# EAGLE design PowerNode.v1 (EAGLE 7.2.0)
ABBREV: aa2; PROJECT: AA Power plug
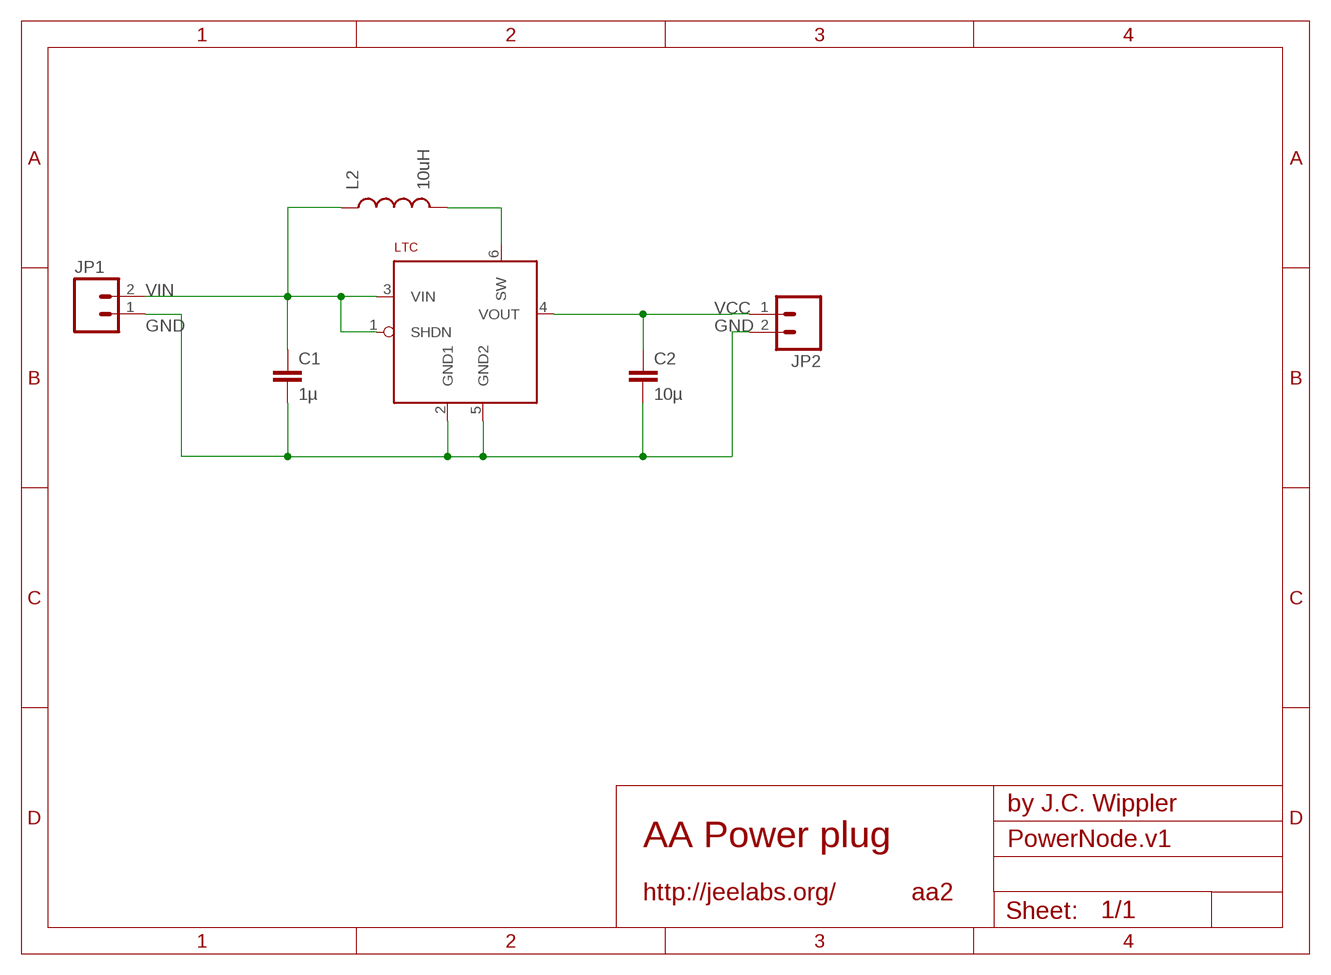
[diagram p0: schematic, sheet 1]

## Parts
C1  1µ  CAP0603-CAP  [0603-CAP]
C2  10µ  CAP0805  [0805]
JP1  M02PTH  [1X02]
JP2  M02PTH  [1X02]
L2  10uH  INDUCTORCR54  [CR54]
LTC  LTC3525  [SC70]

## Nets
GND [power]: C1.2 C2.2 JP1.1 JP2.2 LTC.2(GND1) LTC.5(GND2)
N$4 [power]: L2.P$2 LTC.6(SW)
VCC [power]: C2.1 JP2.1 LTC.4(VOUT)
VIN [power]: C1.1 JP1.2 L2.P$1 LTC.1(SHDN) LTC.3(VIN)

## Library data of the parts
C1 C2 = SparkFun:CAP: Capacitor Standard 0603 ceramic capacitor, and 0.1" leaded capacitor.
JP1 JP2 = SparkFun-Connectors:M02: Standard 2-pin 0.1" header. Use with - straight break away headers ( PRT-00116) - right angle break away headers (PRT-00553) - swiss pins (PRT-00743) - machine pins (PRT-00117) - female headers (PRT-00115) Molex polarized connector foot print use with: PRT-08233 with associated crimp pins and housings. 2.54_SCREWTERM for use with PRT-10571. 3.5mm Screw Terminal footprints for PRT-08084 5mm Screw Terminal footprints for use with PRT-08432
L2 = SparkFun-Passives:INDUCTOR: Inductors Basic Inductor/Choke - 0603 and 1206. Footprints are not proven and vary greatly between part numbers. SRN6045- 33uH, 20% 1.4A SDR0403-560KL - 56uH, 10%, 500mA RMS/740mA peak
LTC = JeeLabs:LTC3525

## Net classes
0 default: width 0.203 mm
1 power: width 0.305 mm, clearance 0.203 mm

## Board
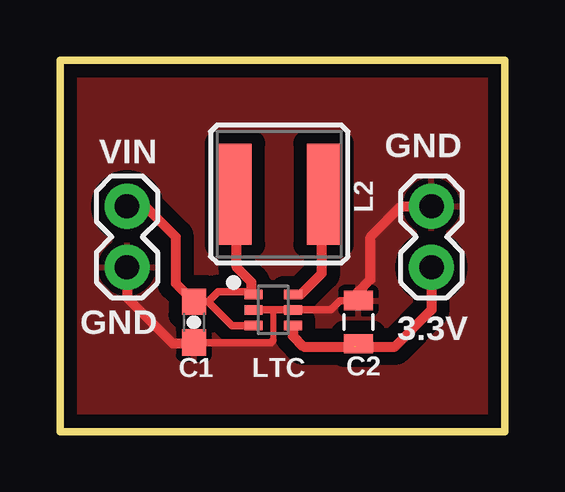
[diagram p1: board, top side]

Size 18.54 x 15.49 mm. Coordinates in mm from the lower left corner, seen from the top.
Outline: 0,0 0,15.49 18.54,15.49 18.54,0 0,0
Copper layers (1*16): Top 0.035mm / dielectric 1.5mm / Bottom 0.035mm
Design rules "default *": minimum track width 8mil, minimum drill 0.4mm, track to track 12mil, track to pad 12mil, pad to pad 12mil, via to via 12mil, smd to smd 12mil, copper to edge 15mil, drill to drill 12mil, minimum pad ring 0.3mm, minimum via ring 8mil, stop-mask expansion 4mil, vias tented up to drill 20mil, thermal gap 10mil

### Footprints (pad centres in the part's own frame; a part is rotated, then mirrored left to right if it is on the bottom)
0603-CAP = smd 1.1 x 1: 1 -0.85,0; 2 0.85,0
0805 = smd 0.8 x 1.2: 1 -0.9,0; 2 0.9,0
1X02 = drill 1.016 pad 1.88: 1 0,0; 2 2.54,0
CR54 = smd 4.2 x 1.4: P$1 0,1.85; P$2 0,-1.85
SC70 = smd 0.4 x 0.75: 1 -0.65,-0.825; 2 0,-0.825; 3 0.65,-0.825; 4 0.65,0.825; 5 0,0.825; 6 -0.65,0.825

### Placement (x,y rotation side)
C1  5.59,4.57 270 top
C2  12.45,4.57 90 top
JP1  2.79,6.86 90 top
JP2  15.49,6.86 90 top
L2  9.14,9.91 90 top
LTC  8.89,5.08 270 top

### Tracks (layer width: path | path; a pad name or v marks a point on that pad's centre or on a via)
GND
  Top 0.254: 8.89,5.08 8.89,3.81
  Top 0.305: LTC.2 8.89,5.08 LTC.5 11.29,5.08 11.68,5.47 C2.2 | C1.2 8.8,3.72 8.89,3.81
  Top 0.406: JP1.1 2.79,5.59 4.7,3.68 5.55,3.68 C1.2 | C2.2 12.45,5.84 12.95,6.35 12.95,8.13 14.22,9.4 JP2.2
  pour Top (isolate 0.559): 19.05,-0.63 -0.76,-0.63 -0.76,16.64 19.05,16.64
N$4
  Top 0.406: 10.67,9.72 L2.P$2 10.92,9.83 10.92,6.6 10.05,5.73 LTC.6
VCC  (1 unrouted)
  Top 0.406: JP2.1 15.49,5.08 13.97,3.56 12.31,3.56 | LTC.4 9.71,4 10.16,3.56 12.33,3.56 C2.1
VIN
  Top 0.305: 7.33,4.43 | 7.33,4.43 LTC.3 | C1.1 6.18,5.42 | 6.18,5.42 6.6,5.84 7.95,5.84 LTC.1 | 7.33,4.43 7.18,4.43 6.18,5.42
  Top 0.406: LTC.1 7.99,5.73 7.99,6.24 7.37,6.86 7.37,9.83 L2.P$1 | JP1.2 3.56,9.4 4.83,8.13 4.83,6.18 C1.1

### Text on the board
tNames: GND | VIN | GND | 3.3V